# Altium schematic sheet lab.SchDoc
size A4; SheetNumber: 1; SheetTotal: 1
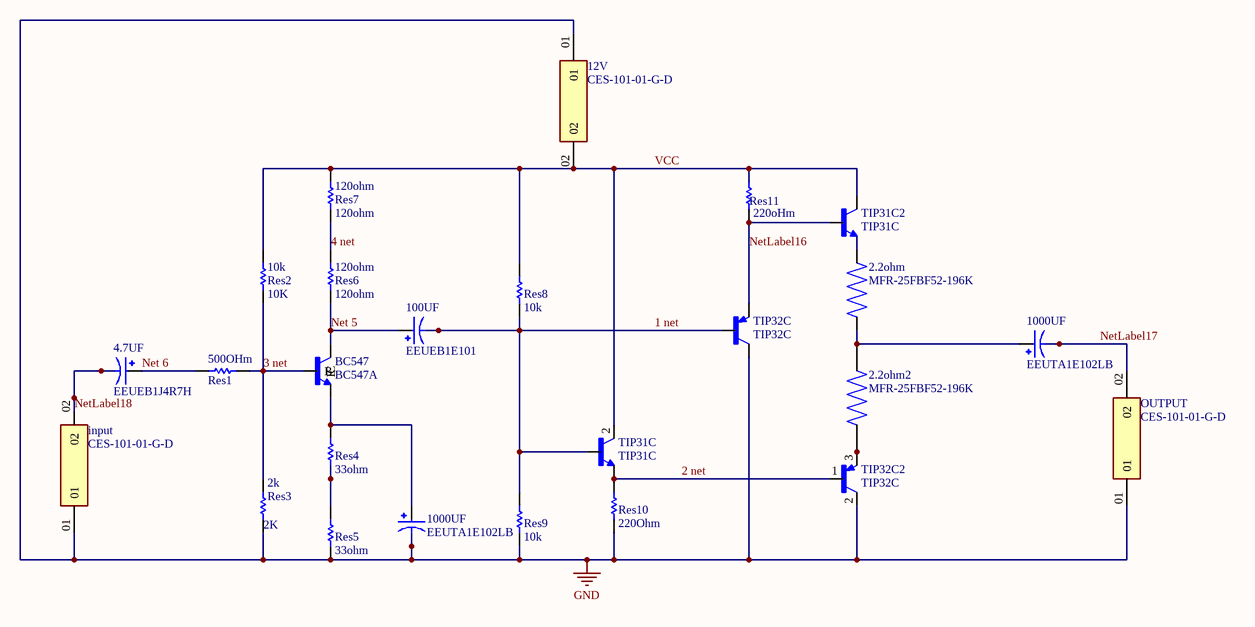
[diagram p0: lab.SchDoc]

## Parts
(Parts that share a designator on the sheet are numbered #1, #2 ... from top to bottom, then left to right.)
2.2ohm  MFR-25FBF52-196K  [RESAD1100W55L680D260]
2.2ohm2  MFR-25FBF52-196K  [RESAD1100W55L680D260]
2k  Res3  value 2K  [AXIAL-0.3]
4.7UF  EEUEB1J4R7H  [CAPPRD250W50D500H1500]
10k#1  Res2  value 10K  [AXIAL-0.3]
10K#2  Res8  value 10k  [AXIAL-0.3]
10K#3  Res9  value 10k  [AXIAL-0.3]
12V  CES-101-01-G-D  [SAMTEC_CES-101-01-G-D]
33ohm#1  Res4  value 33ohm  [AXIAL-0.3]
33ohm#2  Res5  value 33ohm  [AXIAL-0.3]
100UF  EEUEB1E101  [CAPPRD250W50D630H1500]
120ohm#1  Res7  value 120ohm  [AXIAL-0.3]
120ohm#2  Res6  value 120ohm  [AXIAL-0.3]
330ohm#1  Res11  value 220oHm  [AXIAL-0.3]
330ohm#2  Res10  value 220Ohm  [AXIAL-0.3]
500OHm  Res1  [AXIAL-0.3]
1000UF#1  EEUTA1E102LB  [CAPPRD500W60D1250H2500]
1000UF#2  EEUTA1E102LB  [CAPPRD500W60D1250H2500]
BC547  BC547A  [TO92250P510H770-3]
input  CES-101-01-G-D  [SAMTEC_CES-101-01-G-D]
OUTPUT  CES-101-01-G-D  [SAMTEC_CES-101-01-G-D]
TIP31C  TIP31C  [TO220]
TIP31C2  TIP31C  [TO220]
TIP32C  TIP32C  [TO255P1040X460X1968-3]
TIP32C2  TIP32C  [TO255P1040X460X1968-3]

## Nets
GND: 2k.1 10K#3.1 12V.01 33ohm#2.1 330ohm#2.1 1000UF#2.N input.01 OUTPUT.01 TIP32C.2(C) TIP32C2.2(C)
1 net: 10K#2.1 10K#3.2 100UF.N TIP31C.1(B) TIP32C.1(B)
2 net: 330ohm#2.2 TIP31C.3(E) TIP32C2.1(B)
3 net: 2k.2 10k#1.1 500OHm.2 BC547.2(B)
4 net: 120ohm#1.1 120ohm#2.2
Net 5: 100UF.P 120ohm#2.1 BC547.1(C)
Net 6: 4.7UF.P 500OHm.1
NetLabel16: 330ohm#1.1 TIP31C2.1(B) TIP32C.3(E)
NetLabel17: 1000UF#1.N OUTPUT.02
NetLabel18: 4.7UF.N input.02
VCC: 10k#1.2 10K#2.2 12V.02 120ohm#1.2 330ohm#1.2 TIP31C.2(C) TIP31C2.2(C)
Net2.2ohm2_1: 2.2ohm2.1 TIP32C2.3(E)
Net2.2ohm_1: 2.2ohm.1 2.2ohm2.2 1000UF#1.P
Net2.2ohm_2: 2.2ohm.2 TIP31C2.3(E)
Net33ohm#1_1: 33ohm#1.1 33ohm#2.2
Net33ohm#1_2: 33ohm#1.2 1000UF#2.P BC547.3(E)

## Library data of the parts
2.2ohm 2.2ohm2 = MFR-25FBF52-196K: RES 280K OHM 1/4W 1% AXIAL; Package: None; Price: None; Value: *; MP: MFR-25FBF52-196K; Availability: Unavailable
2k 10k#1 10K#2 10K#3 33ohm#1 33ohm#2 120ohm#1 120ohm#2 330ohm#1 330ohm#2 = Res1: Resistor; Published: 8-Jun-2000; LatestRevisionDate: 17-Jul-2002; LatestRevisionNote: Re-released for DXP Platform.; PackageReference: AXIAL-0.3; Publisher: Altium Limited; PackageDescription: Axial Device, Thru-Hole; 2 Leads; 0.3 in Pin Spacing
4.7UF = EEUEB1J4R7H: CAP ALUM 4.7UF 20% 63V RADIAL; MF: Panasonic; Availability: In Stock; MP: EEUEB1J4R7H; Price: None; Check_prices: https://www.snapeda.com/parts/EEUEB1J4R7H/Panasonic/view-part/?ref=eda; Value: *; SnapEDA_Link: https://www.snapeda.com/parts/EEUEB1J4R7H/Panasonic/view-part/?ref=snap; Purchase-URL: https://pricing.snapeda.com/search/part/EEUEB1J4R7H/?ref=eda; Package: RADIAL-2 Panasonic
100UF = EEUEB1E101: CAP ALUM 100UF 20% 25V RADIAL; MF: Panasonic; Check_prices: https://www.snapeda.com/parts/EEUEB1E101/Panasonic/view-part/?ref=eda; Value: *; Availability: In Stock; MP: EEUEB1E101; Price: None; Package: RADIAL-2 Panasonic; SnapEDA_Link: https://www.snapeda.com/parts/EEUEB1E101/Panasonic/view-part/?ref=snap; Purchase-URL: https://pricing.snapeda.com/search/part/EEUEB1E101/?ref=eda
500OHm = Res1: Resistor; R1: 440ohm; Published: 8-Jun-2000; LatestRevisionDate: 17-Jul-2002; LatestRevisionNote: Re-released for DXP Platform.; PackageReference: AXIAL-0.3; Publisher: Altium Limited; PackageDescription: Axial Device, Thru-Hole; 2 Leads; 0.3 in Pin Spacing
1000UF#1 1000UF#2 = EEUTA1E102LB: CAP ALUM 1000UF 20% 25V RADIAL; MF: Panasonic; MP: EEUTA1E102LB; Package: RADIAL-2 Panasonic; Availability: No availability data; Price: None; Check_prices: https://www.snapeda.com/parts/EEUTA1E102LB/Panasonic/view-part/5789306/?ref=eda; SnapEDA_Link: https://www.snapeda.com/parts/EEUTA1E102LB/Panasonic/view-part/5789306/?ref=snap; Value: *
BC547 = BC547A: Bipolar (BJT) Transistor NPN 45 V 100 mA 300MHz 625 mW Through Hole TO-92 (TO-226); MF: ON Semiconductor; Price: None; MP: BC547A; Purchase-URL: https://pricing.snapeda.com/search/part/BC547A/?ref=eda; Package: E-PKG AXIAL-LEADED-2 ON Semiconductor; Check_prices: https://www.snapeda.com/parts/BC547A/Onsemi/view-part/?ref=eda; SnapEDA_Link: https://www.snapeda.com/parts/BC547A/Onsemi/view-part/?ref=snap; Value: *; Availability: In Stock
TIP31C TIP31C2 = TIP31C: Bipolar _BJT_ Transistor NPN 100V 3A 3MHz 2W Through Hole TO-220AB; MF: Renesas Electronics; Availability: Unavailable; SnapEDA_Link: https://www.snapeda.com/parts/TIP31C/Renesas%20Electronics%20America%20Inc./view-part/1915707/?ref=snap; Value: *; Price: None; Package: TO-220 Multicomp; MP: TIP31C
TIP32C TIP32C2 = TIP32C: BIPOLAR TRANSISTOR, PNP, -100V, TO-220; Transistor Polarity: P Channel; Collector Emitter Voltage V(br)ceo: -100V; Tr...; MF: Central Semiconductor; Check_prices: https://www.snapeda.com/parts/TIP32C/Central+Semiconductor+Corp/view-part/?ref=eda; Value: *; Availability: Not in stock; MP: TIP32C; Price: None; Package: TO-220-3 Central Semiconductor; SnapEDA_Link: https://www.snapeda.com/parts/TIP32C/Central+Semiconductor+Corp/view-part/?ref=snap
12V input OUTPUT = CES-101-01-G-D: Package: None; Price: None; Value: *; MP: CES-101-01-G-D; Availability: Unavailable